# EAGLE schematic schematic_basic_active_crystal_osc_digital_audio_esp32 (EAGLE 9.6.2)
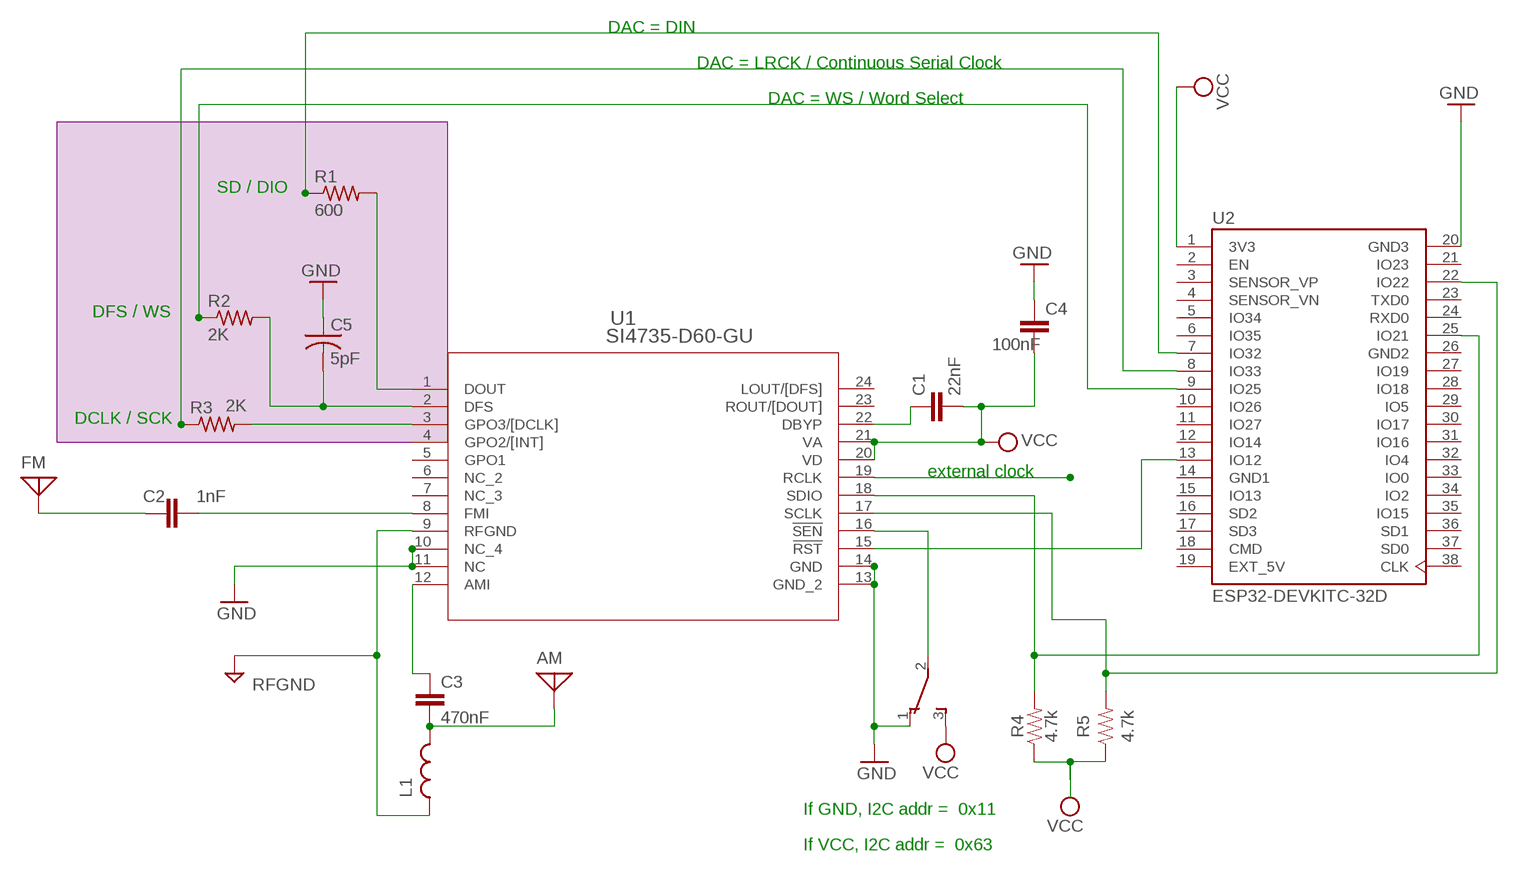
[diagram p0: schematic, sheet 1]

## Parts
AM  ANTENNA  [PAD-01]
C1  22nF  22NF/22,000PF-0603-50V-10%  [0603]
C2  1nF  CXXC10B6  [XC10B6]
C3  470nF  CXXC10B6  [XC10B6]
C4  100nF  CXXC10B6  [XC10B6]
C5  5pF  C-US025-024X044  [C025-024X044]
FM  ANTENNA  [PAD-01]
L1  L  (no package)
R1  600  R-US_0204/2V  [0204V]
R2  2K  R-US_0204/2V  [0204V]
R3  2K  R-US_0204/2V  [0204V]
R4  4.7k  4.7KOHM-0603-1/10W-1%  [0603]
R5  4.7k  4.7KOHM-0603-1/10W-1%  [0603]
S1  TL36WO  [TL3XWO]
U1  SI4735-D60-GU  [SSOP24_SIL]
U2  ESP32-DEVKITC-32D  [MODULE_ESP32-DEVKITC-32D]

## Nets
GND: C4.1 C5.1 L1.1 S1.1(O) U1.9(RFGND) U1.10(NC_4) U1.11(NC) U1.13(GND_2) U1.14(GND) U2.20(GND3)
N$1: U1.15(!RST) U2.13(IO12)
N$2: S1.2(P) U1.16(!SEN)
N$3: U1.19(RCLK)
N$4: C1.1 U1.22(DBYP)
N$5: R1.2 U1.1(DOUT)
N$10: AM.1 C3.2 L1.2
N$11: C5.2 R2.2 U1.2(DFS)
N$12: C3.1 U1.12(AMI)
N$13: C2.2 U1.8(FMI)
N$14: C2.1 FM.1
N$16: R3.2 U1.3(GPO3/[DCLK])
N$17: R1.1 U2.7(IO32)
N$18: R2.1 U2.9(IO25)
N$19: R3.1 U2.8(IO33)
N$21: R4.2 U1.18(SDIO) U2.25(IO21)
SDA: R5.2 U1.17(SCLK) U2.22(IO22)
VCC: C1.2 C4.2 R4.1 R5.1 S1.3(S) U1.20(VD) U1.21(VA) U2.1(3V3)
Unconnected: U1.4(GPO2/[INT]) U1.5(GPO1) U1.6(NC_2) U1.7(NC_3) U1.23(ROUT/[DOUT]) U1.24(LOUT/[DFS]) U2.2(EN) U2.3(SENSOR_VP) U2.4(SENSOR_VN) U2.5(IO34) U2.6(IO35) U2.10(IO26) U2.11(IO27) U2.12(IO14) U2.15(IO13) U2.16(SD2) U2.17(SD3) U2.18(CMD) U2.21(IO23) U2.23(TXD0) U2.24(RXD0) U2.27(IO19) U2.28(IO18) U2.29(IO5) U2.30(IO17) U2.31(IO16) U2.32(IO4) U2.33(IO0) U2.34(IO2) U2.35(IO15) U2.36(SD1) U2.37(SD0) U2.38(CLK)

## Notes on the sheet
- DAC = DIN
- DAC = LRCK / Continuous Serial Clock
- DAC = WS / Word Select
- SD / DIO
- DFS / WS
- DCLK / SCK
- external clock
- If GND, I2C addr =  0x11
- If VCC, I2C addr =  0x63

## Power pins joined to a net without a drawn wire
EXT_5V: U2.19(EXT_5V)
GND1: U2.14(GND1)
GND2: U2.26(GND2)

## Library data of the parts
AM FM = discrete:ANTENNA: Antenna
C1 = SparkFun-Capacitors:22NF/22,000PF: 0.022uF/22nF/22,000pF ceramic capacitors A capacitor is a passive two-terminal electrical component used to store electrical energy temporarily in an electric field.; PROD_ID: CAP-07885
C2-C4 = rcl:CX: X CAPACITOR for power line; SPICEPREFIX: C
C5 = adafruit:C-US: CAPACITOR, American symbol
L1 = ngspice-simulation:L: INDUCTOR
R1-R3 = rcl:R-US_: RESISTOR, American symbol; SPICEPREFIX: R
R4 R5 = SparkFun-Resistors:4.7KOHM: 4.7kΩ resistor A resistor is a passive two-terminal electrical component that implements electrical resistance as a circuit element. Resistors act to reduce current flow, and, at the same time, act to lower voltage levels within circuits. - Wikipedia; PROD_ID: RES-07857
S1 = switch:TL36WO: TINY SWITCH ON - ON Source: http://www2.produktinfo.conrad.com/datenblaetter/700000-724999/705152-da-01-de-Subminiaturschalter_TL_36WO.pdf
U1 = si4735:SI4735-D60-GU; BUILT_BY: EMA_Cory; COPYRIGHT: Copyright (C) 2018 Accelerated Designs. All rights reserved; DATASHEET: https://www.silabs.com/documents/public/data-sheets/Si4730-31-34-35-D60.pdf; MANUFACTURER_PART_NUMBER: SI4735-D60-GU; SOURCELIBRARY: Silicon_Labs_2020-04-23; VENDOR: Silicon Labs
U2 = ESP32-DEVKITC-32D:ESP32-DEVKITC-32D: Eval Board For Esp-Wroom-32 Check prices <https://pricing.snapeda.com/parts/ESP32-DEVKITC-32D/Espressif%20Systems/view-part?ref=eda>; AVAILABILITY: Warning; DESCRIPTION: WiFi Development Tools (802.11) ESP32 General Development Kit, ESP32-WROOM-32D on the board; MF: Espressif Systems; MP: ESP32-DEVKITC-32D; PACKAGE: None; PRICE: None; PURCHASE-URL: https://pricing.snapeda.com/search/part/ESP32-DEVKITC-32D/?ref=eda